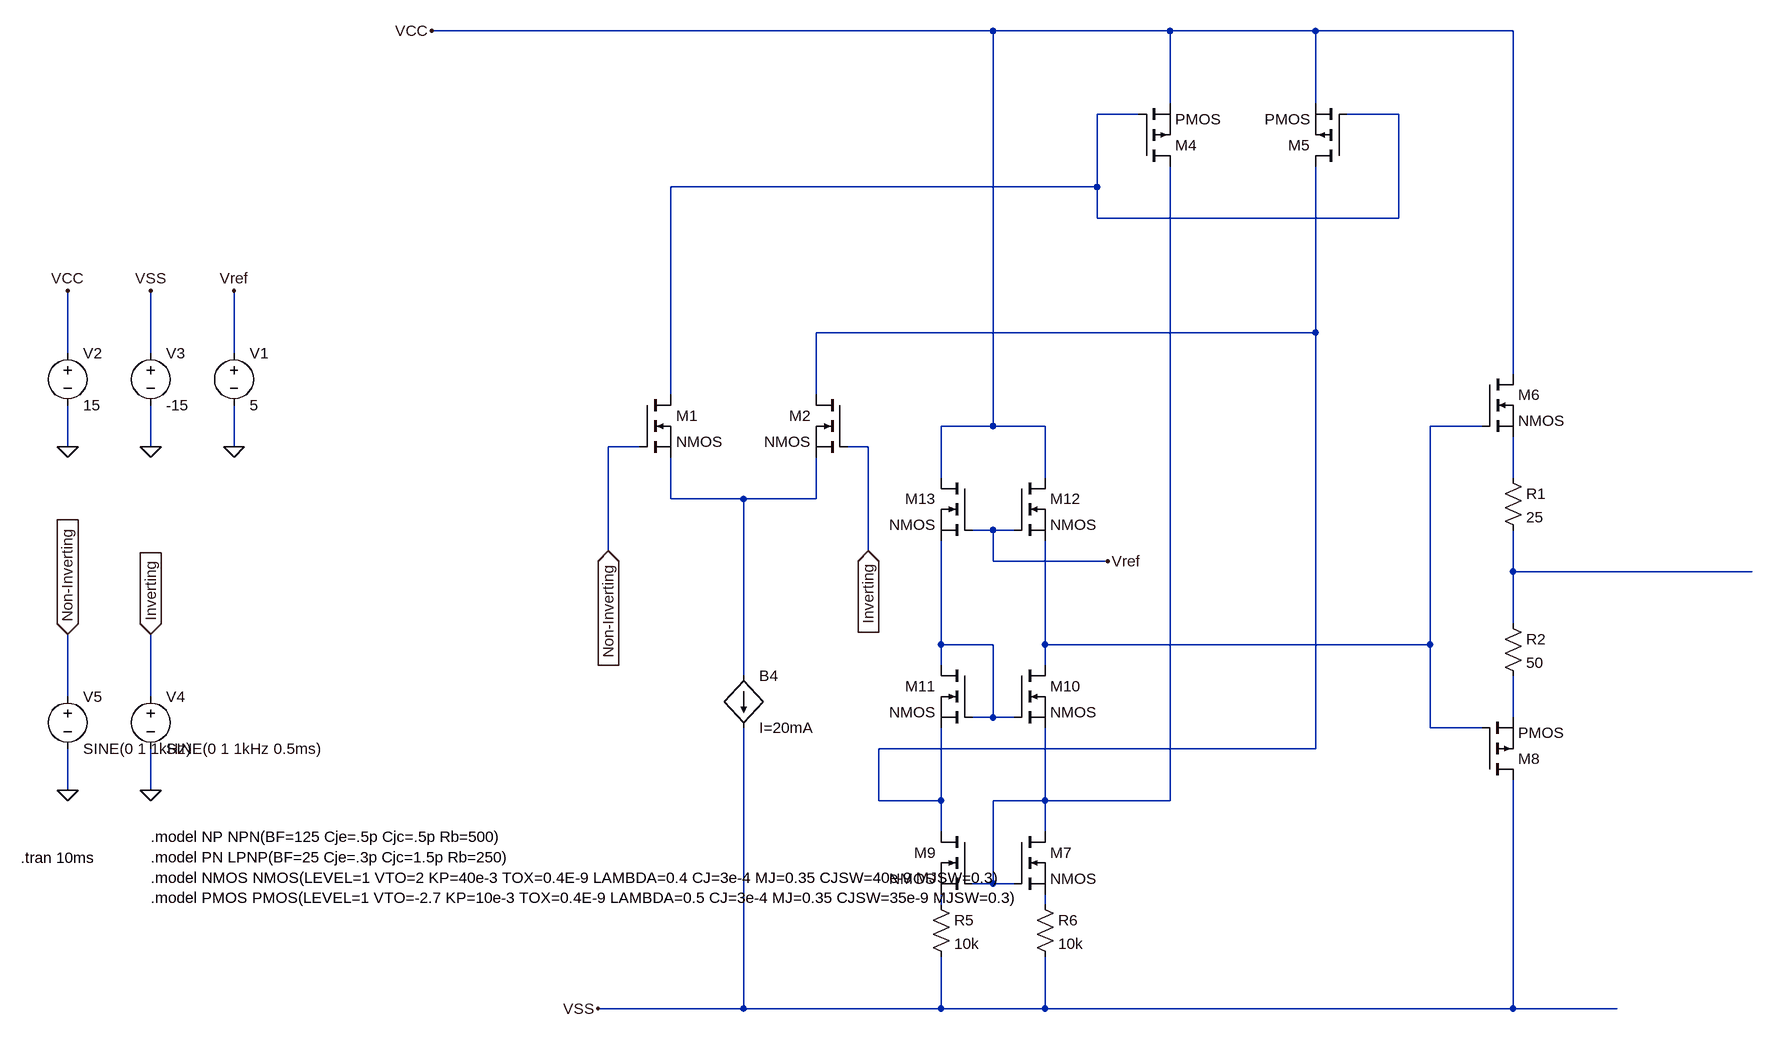
[diagram p0: schematic m_Opamp_VLSI_MOS_SS.asc]
m_Opamp_VLSI_MOS_SS.asc, the LTspice schematic file:
Version 4
SHEET 1 880 868
WIRE -976 -704 -1840 -704
WIRE -704 -704 -976 -704
WIRE -480 -704 -704 -704
WIRE -176 -704 -480 -704
WIRE -704 -592 -704 -704
WIRE -480 -592 -480 -704
WIRE -752 -576 -816 -576
WIRE -352 -576 -432 -576
WIRE -816 -464 -816 -576
WIRE -816 -464 -1472 -464
WIRE -816 -416 -816 -464
WIRE -352 -416 -352 -576
WIRE -352 -416 -816 -416
WIRE -480 -240 -480 -496
WIRE -480 -240 -1248 -240
WIRE -2400 -208 -2400 -304
WIRE -2272 -208 -2272 -304
WIRE -2144 -208 -2144 -304
WIRE -176 -176 -176 -704
WIRE -1472 -144 -1472 -464
WIRE -1248 -144 -1248 -240
WIRE -976 -96 -976 -704
WIRE -976 -96 -1056 -96
WIRE -896 -96 -976 -96
WIRE -224 -96 -304 -96
WIRE -2400 -64 -2400 -128
WIRE -2272 -64 -2272 -128
WIRE -2144 -64 -2144 -128
WIRE -1520 -64 -1568 -64
WIRE -1168 -64 -1200 -64
WIRE -1056 -16 -1056 -96
WIRE -896 -16 -896 -96
WIRE -176 -16 -176 -80
WIRE -1472 16 -1472 -48
WIRE -1360 16 -1472 16
WIRE -1248 16 -1248 -48
WIRE -1248 16 -1360 16
WIRE -976 64 -1008 64
WIRE -944 64 -976 64
WIRE -1568 96 -1568 -64
WIRE -1168 96 -1168 -64
WIRE -976 112 -976 64
WIRE -800 112 -976 112
WIRE -176 128 -176 64
WIRE 192 128 -176 128
WIRE -176 208 -176 128
WIRE -1056 240 -1056 80
WIRE -976 240 -1056 240
WIRE -896 240 -896 80
WIRE -304 240 -304 -96
WIRE -304 240 -896 240
WIRE -1056 272 -1056 240
WIRE -896 272 -896 240
WIRE -1360 288 -1360 16
WIRE -2400 320 -2400 224
WIRE -2272 320 -2272 224
WIRE -976 352 -976 240
WIRE -976 352 -1008 352
WIRE -944 352 -976 352
WIRE -176 352 -176 288
WIRE -304 368 -304 240
WIRE -224 368 -304 368
WIRE -480 400 -480 -240
WIRE -480 400 -1152 400
WIRE -2400 464 -2400 400
WIRE -2272 464 -2272 400
WIRE -1152 480 -1152 400
WIRE -1056 480 -1056 368
WIRE -1056 480 -1152 480
WIRE -896 480 -896 368
WIRE -896 480 -976 480
WIRE -704 480 -704 -496
WIRE -704 480 -896 480
WIRE -1056 528 -1056 480
WIRE -896 528 -896 480
WIRE -976 608 -976 480
WIRE -976 608 -1008 608
WIRE -944 608 -976 608
WIRE -1056 640 -1056 624
WIRE -896 640 -896 624
WIRE -1360 800 -1360 368
WIRE -1360 800 -1584 800
WIRE -1056 800 -1056 720
WIRE -1056 800 -1360 800
WIRE -896 800 -896 720
WIRE -896 800 -1056 800
WIRE -176 800 -176 448
WIRE -176 800 -896 800
WIRE -16 800 -176 800
FLAG -1568 96 Non-Inverting
IOPIN -1568 96 In
FLAG -1168 96 Inverting
IOPIN -1168 96 In
FLAG -2144 -64 0
FLAG -2144 -304 Vref
FLAG -2272 -64 0
FLAG -2400 -64 0
FLAG -2400 -304 VCC
FLAG -2272 -304 VSS
FLAG -1840 -704 VCC
FLAG -2272 464 0
FLAG -2400 464 0
FLAG -2400 224 Non-Inverting
IOPIN -2400 224 In
FLAG -2272 224 Inverting
IOPIN -2272 224 In
FLAG -1584 800 VSS
FLAG -800 112 Vref
SYMBOL voltage -2144 -224 R0
WINDOW 123 0 0 Left 0
WINDOW 39 0 0 Left 0
SYMATTR InstName V1
SYMATTR Value 5
SYMBOL voltage -2400 -224 R0
SYMATTR InstName V2
SYMATTR Value 15
SYMBOL voltage -2272 -224 R0
WINDOW 123 0 0 Left 0
WINDOW 39 0 0 Left 0
SYMATTR InstName V3
SYMATTR Value -15
SYMBOL voltage -2272 304 R0
WINDOW 123 0 0 Left 0
WINDOW 39 0 0 Left 0
SYMATTR InstName V4
SYMATTR Value SINE(0 1 1kHz 0.5ms)
SYMBOL voltage -2400 304 R0
WINDOW 123 0 0 Left 0
WINDOW 39 0 0 Left 0
SYMATTR InstName V5
SYMATTR Value SINE(0 1 1kHz)
SYMBOL res -192 -32 R0
SYMATTR InstName R1
SYMATTR Value 25
SYMBOL res -192 192 R0
SYMATTR InstName R2
SYMATTR Value 50
SYMBOL nmos -1520 -144 R0
SYMATTR InstName M1
SYMBOL nmos -1200 -144 M0
SYMATTR InstName M2
SYMBOL pmos -752 -496 M180
SYMATTR InstName M4
SYMBOL pmos -432 -496 R180
SYMATTR InstName M5
SYMBOL nmos -224 -176 R0
SYMATTR InstName M6
SYMBOL pmos -224 448 M180
SYMATTR InstName M8
SYMBOL res -1072 624 R0
SYMATTR InstName R5
SYMATTR Value 10k
SYMBOL res -912 624 R0
SYMATTR InstName R6
SYMATTR Value 10k
SYMBOL nmos -944 528 R0
SYMATTR InstName M7
SYMBOL nmos -1008 528 M0
SYMATTR InstName M9
SYMBOL nmos -944 272 R0
SYMATTR InstName M10
SYMBOL nmos -1008 272 M0
SYMATTR InstName M11
SYMBOL nmos -944 -16 R0
SYMATTR InstName M12
SYMBOL nmos -1008 -16 M0
SYMATTR InstName M13
SYMBOL bi -1360 288 R0
SYMATTR InstName B4
SYMATTR Value I=20mA
TEXT -2272 536 Left 2 !.model NP NPN(BF=125 Cje=.5p Cjc=.5p Rb=500)\n.model PN LPNP(BF=25 Cje=.3p Cjc=1.5p Rb=250)\n.model NMOS NMOS(LEVEL=1 VTO=2 KP=40e-3 TOX=0.4E-9 LAMBDA=0.4 CJ=3e-4 MJ=0.35 CJSW=40e-9 MJSW=0.3)\n.model PMOS PMOS(LEVEL=1 VTO=-2.7 KP=10e-3 TOX=0.4E-9 LAMBDA=0.5 CJ=3e-4 MJ=0.35 CJSW=35e-9 MJSW=0.3)
TEXT -2472 568 Left 2 !.tran 10ms

The netlist it stands for:
* m_Opamp_VLSI_MOS_SS.asc
V1 Vref 0 5
V2 VCC 0 15
V3 VSS 0 -15
V4 Inverting 0 SINE(0 1 1kHz 0.5ms)
V5 Non-Inverting 0 SINE(0 1 1kHz)
R1 N004 N006 25
R2 N006 N008 50
M1 N001 Non-Inverting N005 N005 NMOS
M2 N002 Inverting N005 N005 NMOS
M4 N009 N001 VCC VCC PMOS
M5 N002 N001 VCC VCC PMOS
M6 VCC N003 N004 N004 NMOS
M8 VSS N003 N008 N008 PMOS
R5 N010 VSS 10k
R6 N011 VSS 10k
M7 N009 N009 N011 N011 NMOS
M9 N002 N009 N010 N010 NMOS
M10 N003 N007 N009 N009 NMOS
M11 N007 N007 N002 N002 NMOS
M12 VCC Vref N003 N003 NMOS
M13 VCC Vref N007 N007 NMOS
B4 N005 VSS I=20mA
.model NMOS NMOS
.model PMOS PMOS
.lib standard.mos
.model NP NPN(BF=125 Cje=.5p Cjc=.5p Rb=500)
.model PN LPNP(BF=25 Cje=.3p Cjc=1.5p Rb=250)
.model NMOS NMOS(LEVEL=1 VTO=2 KP=40e-3 TOX=0.4E-9 LAMBDA=0.4 CJ=3e-4 MJ=0.35 CJSW=40e-9 MJSW=0.3)
.model PMOS PMOS(LEVEL=1 VTO=-2.7 KP=10e-3 TOX=0.4E-9 LAMBDA=0.5 CJ=3e-4 MJ=0.35 CJSW=35e-9 MJSW=0.3)
.tran 10ms
.backanno
.end